# Altium schematic sheet Clock.SchDoc
size A2
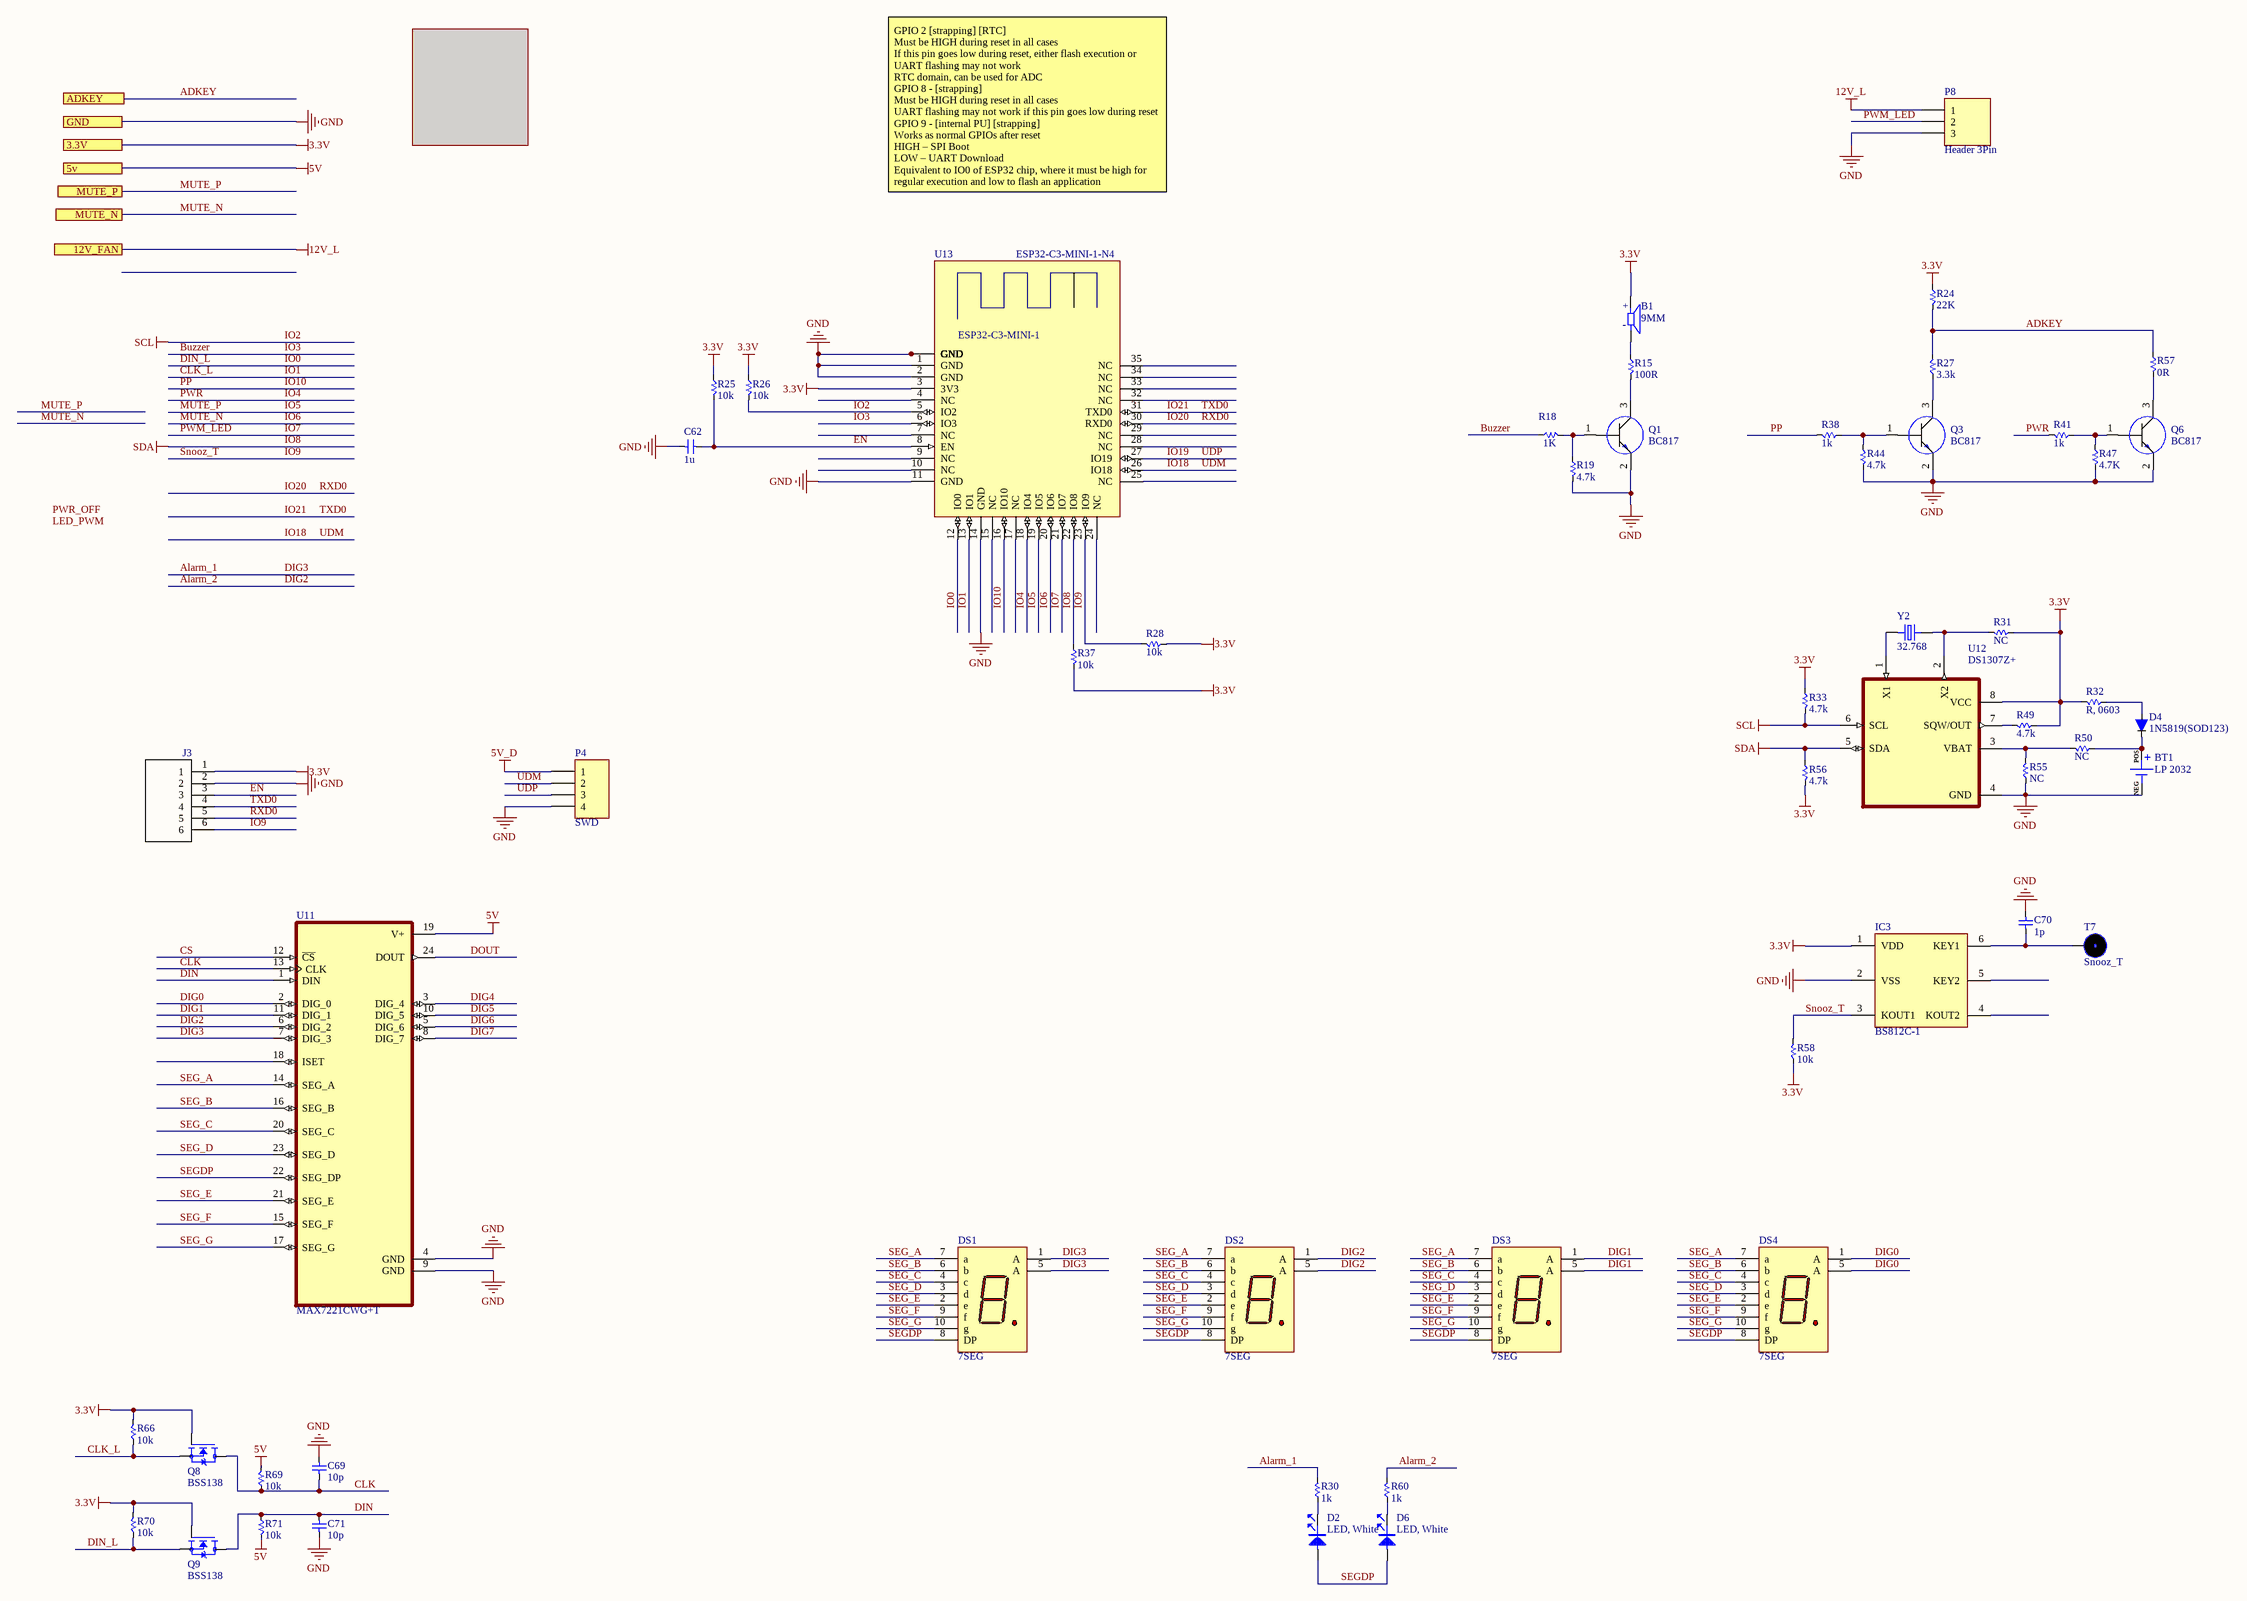
[diagram p0: Clock.SchDoc]

## Parts
B1  9MM  [Buzzer-TMB09A05]
BT1  LP 2032  [battery Holder 2032]
C62  1u  [cap0603]
C69  10p  [cap0603]
C70  1p  [cap0603]
C71  10p  [cap0603]
D2  LED, White  [LED 1206]
D4  1N5819(SOD123)  [1N5819 SOD-123]
D6  LED, White  [LED 1206]
DS1  7SEG  [7Seg 90*60 - No Wiring COMMON Cathod - 1206]
DS2  7SEG  [7Seg 90*60 - No Wiring COMMON Cathod - 1206]
DS3  7SEG  [7Seg 90*60 - No Wiring COMMON Cathod - 1206]
DS4  7SEG  [7Seg 90*60 - No Wiring COMMON Cathod - 1206]
IC3  BS812C-1  [BS812C-1]
J3  NC  [pin header1*6]  (value not drawn)
P4  SWD  [HDR1X4H]
P8  Header 3Pin  [CONN-PHOENIX-3.81 3Pin]
Q1  BC817  [BJT SS805]
Q3  BC817  [BJT SS805]
Q6  BC817  [BJT SS805]
Q8  BSS138  [BSS138]
Q9  BSS138  [BSS138]
R15  100R  [RES-0603]
R18  1K  [RES-0603]
R19  4.7k  [RES-0603]
R24  22K  [RES-0603]
R25  10k  [RES-0603]
R26  10k  [RES-0603]
R27  3.3k  [RES-0603]
R28  10k  [RES-0603]
R30  1k  [RES-0603]
R31  NC  [RES-0603]
R32  R, 0603  [RES-0603]
R33  4.7k  [RES-0603]
R37  10k  [RES-0603]
R38  1k  [RES-0603]
R41  1k  [RES-0603]
R44  4.7k  [RES-0603]
R47  4.7K  [RES-0603]
R49  4.7k  [RES-0603]
R50  NC  [RES-0603]
R55  NC  [RES-0603]
R56  4.7k  [RES-0603]
R57  0R  [RES-0603]
R58  10k  [RES-0603]
R60  1k  [RES-0603]
R66  10k  [RES-0603]
R69  10k  [RES-0603]
R70  10k  [RES-0603]
R71  10k  [RES-0603]
T7  Snooz_T  [Touch pad CIRCULE - 5mm]
U11  MAX7221CWG+T  [MAX7221CWG]
U12  DS1307Z+  [DS1307]
U13  ESP32-C3-MINI-1-N4  [ESP32-C3-MINI-1]
Y2  32.768  [Crystal_AB38T-32.768KHZ]

## Ports
3.3V, 5v, 12V_FAN, ADKEY, GND, MUTE_N, MUTE_P

## Nets
3.3V: B1.P IC3.1(VDD) J3.1 Q8.1(G) Q9.1(G) R24.1 R25.1 R26.1 R28.1 R31.1 R32.2 R33.1 R37.2 R49.1 R56.2 R58.1 R66.2 R70.2 U12.8(VCC) U13.3(3V3) ; port 3.3V
5V: R69.2 R71.2 U11.19(V+) ; port 5v
5V_D: P4.1
12V_L: P8.1 ; port 12V_FAN
GND: BT1.NEG C62.1 C69.1 C70.2 C71.2 IC3.2(VSS) J3.2 P4.4 P8.3 Q1.2(E) Q3.2(E) Q6.2(E) R19.2 R44.2 R47.2 R55.1 U11.4(GND) U11.9(GND) U12.4(GND) U13.1(GND) U13.2(GND) U13.11(GND) U13.14(GND) U13.36(GND) U13.37(GND) U13.38(GND) U13.39(GND) U13.40(GND) U13.41(GND) U13.42(GND) U13.43(GND) U13.44(GND) U13.45(GND) U13.46(GND) U13.47(GND) U13.48(GND) U13.49_1(GND) U13.49_2(GND) U13.49_3(GND) U13.49_4(GND) U13.49_5(GND) U13.49_6(GND) U13.49_7(GND) U13.49_8(GND) U13.49_9(GND) U13.50(GND) U13.51(GND) U13.52(GND) U13.53(GND) ; port GND
IO2: R26.2 R33.2 U12.6(SCL) U13.5(IO2)  [also labelled SCL]
IO8: R37.1 R56.1 U12.5(SDA) U13.22(IO8)  [also labelled SDA]
ADKEY: R24.2 R27.2 R57.1 ; port ADKEY
Alarm_1: DS1.1(A) DS1.5(A) R30.2 U11.7(DIG_3)  [also labelled DIG3]
Alarm_2: DS2.1(A) DS2.5(A) R60.2 U11.6(DIG_2)  [also labelled DIG2]
Buzzer: R18.1 U13.6(IO3)  [also labelled IO3]
CLK: C69.2 Q8.3(D) R69.1 U11.13(CLK)
CLK_L: Q8.2(S) R66.1 U13.13(IO1)  [also labelled IO1]
CS: U11.12(~{CS})
DIG0: DS4.1(A) DS4.5(A) U11.2(DIG_0)
DIG1: DS3.1(A) DS3.5(A) U11.11(DIG_1)
DIG4: U11.3(DIG_4)
DIG5: U11.10(DIG_5)
DIG6: U11.5(DIG_6)
DIG7: U11.8(DIG_7)
DIN: C71.1 Q9.3(D) R71.1 U11.1(DIN)
DIN_L: Q9.2(S) R70.1 U13.12(IO0)  [also labelled IO0]
DOUT: U11.24(DOUT)
EN: C62.2 J3.3 R25.2 U13.8(EN)
IO4: R41.2 U13.18(IO4)  [also labelled PWR]
IO5: U13.19(IO5) ; port MUTE_P  [also labelled MUTE_P]
IO6: U13.20(IO6) ; port MUTE_N  [also labelled MUTE_N]
IO7: P8.2 U13.21(IO7)  [also labelled PWM_LED]
IO9: IC3.3(KOUT1) J3.6 R28.2 R58.2 U13.23(IO9)  [also labelled Snooz_T]
IO10: R38.2 U13.16(IO10)  [also labelled PP]
IO18: P4.2 U13.26(IO18)  [also labelled UDM]
IO19: P4.3 U13.27(IO19)  [also labelled UDP]
IO20: J3.5 U13.30(RXD0)  [also labelled RXD0]
IO21: J3.4 U13.31(TXD0)  [also labelled TXD0]
SEG_A: DS1.7(a) DS2.7(a) DS3.7(a) DS4.7(a) U11.14(SEG_A)
SEG_B: DS1.6(b) DS2.6(b) DS3.6(b) DS4.6(b) U11.16(SEG_B)
SEG_C: DS1.4(c) DS2.4(c) DS3.4(c) DS4.4(c) U11.20(SEG_C)
SEG_D: DS1.3(d) DS2.3(d) DS3.3(d) DS4.3(d) U11.23(SEG_D)
SEG_E: DS1.2(e) DS2.2(e) DS3.2(e) DS4.2(e) U11.21(SEG_E)
SEG_F: DS1.9(f) DS2.9(f) DS3.9(f) DS4.9(f) U11.15(SEG_F)
SEG_G: DS1.10(g) DS2.10(g) DS3.10(g) DS4.10(g) U11.17(SEG_G)
SEGDP: D2.2 D6.2 DS1.8(DP) DS2.8(DP) DS3.8(DP) DS4.8(DP) U11.22(SEG_DP)
NetB1_N: B1.N R15.1
NetBT1_POS: BT1.POS D4.1(A) R50.1
NetC70_1: C70.1 IC3.6(KEY1) T7.1
NetD2_1: D2.1 R30.1
NetD4_2: D4.2(C) R32.1
NetD6_1: D6.1 R60.1
NetQ1_1: Q1.1(B) R18.2 R19.1
NetQ1_3: Q1.3(C) R15.2
NetQ3_1: Q3.1(B) R38.1 R44.1
NetQ3_3: Q3.3(C) R27.1
NetQ6_1: Q6.1(B) R41.1 R47.1
NetQ6_3: Q6.3(C) R57.2
NetR31_2: R31.2 U12.2(X2) Y2.2
NetR49_2: R49.2 U12.7(SQW/OUT)
NetR50_2: R50.2 R55.2 U12.3(VBAT)
NetU12_1: U12.1(X1) Y2.1

Not connected (* = marked no-connect by the designer): IC3 4(KOUT2) 5(KEY2); U11 18(ISET); U13 4(NC) 7(NC) 9(NC) 10(NC) 15(NC) 17(NC) 24(NC) 25(NC) 28(NC) 29(NC) 32(NC) 33(NC) 34(NC) 35(NC)

## Notes on the sheet
- GPIO 2 [strapping] [RTC]
  Must be HIGH during reset in all cases
  If this pin goes low during reset, either flash execution or UART flashing may not work
  RTC domain, can be used for ADC
  GPIO 8 - [strapping]
  Must be HIGH during reset in all cases
  UART flashing may not work if this pin goes low during reset
  GPIO 9 - [internal PU] [strapping]
  Works as normal GPIOs after reset
  HIGH – SPI Boot
  LOW – UART Download
  Equivalent to IO0 of ESP32 chip, where it must be high for regular execution and low to flash an application
- Labels drawn without touching a wire or pin: LED_PWM, PWR_OFF
- (in symbol Buzzer_9MM) +; -
- (in symbol ESP32-C3-MINI-1-N4) ESP32-C3-MINI-1

## Library data of the parts
B1 = Buzzer_9MM: 09 mm, 5 V, 85 dB, Through Hole, Magnetic Audio Transducer Buzzer; MF: CUI Devices; MP: CEM-1203(42); Package: None; Price: None; Check_prices: https://www.snapeda.com/parts/CEM-1203(42)/CUI+Devices/view-part/?ref=eda; Value: *; CUI_purchase_URL: https://www.cuidevices.com/product/audio/buzzers/audio-transducers/cem-1203(42)?utm_source=snapeda.com&utm_medium=referral&utm_campaign=snapedaBOM; SnapEDA_Link: https://www.snapeda.com/parts/CEM-1203(42)/CUI+Devices/view-part/?ref=snap; Availability: In Stock; Purchase-URL: https://pricing.snapeda.com/search/part/CEM-1203(42)/?ref=eda
BT1 = Battery Holder 2032: Battery Holder (Open) Coin, 20.0mm 1 Cell SMD (SMT) Tab; MP: LP2032SM-JJ-GTR; MF: MPD; DigiKey-Purchase-URL: https://snapeda.com/shop?store=DigiKey&id=288457; Value: *; Package: Non-Standard MPD; Price: None; SnapEDA_Link: https://www.snapeda.com/parts/LP2032SM-JJ-GTR/MPD%20(Memory%20Protection%20Devices)/view-part/288457/?ref=snap; Availability: Warning
C62 C69-C71 = Cap 0603: Capacitor 0603; Value: 104; Published: 8-Jun-2000; LatestRevisionDate: 17-Jul-2002; LatestRevisionNote: Re-released for DXP Platform.; Publisher: Altium Limited
D2 D6 = LED_red 1206: LED, red, 1206; Manuf_1: everlight; Manuf_Part_1: 19-213-R6C-AP1Q2B/3T; ECCN_US/EU: EAR99/NEC; Order: 19-213-R6C-AP1Q2B/3T
D4 = 1N5819(SOD123): Shotkey diod SOD-123; MP: BAS716; MF: Nexperia USA; SnapEDA_Link: https://www.snapeda.com/parts/BAS716/Nexperia%20USA%20Inc./view-part/143287/?ref=snap; Price: None; Package: SOD-523 NXP Semiconductors; Arrow_Electronics-Purchase-URL: https://snapeda.com/shop?store=Arrow+Electronics&id=143287; Value: *; Availability: Unavailable
DS1-DS4 = 7SEG 90*60mm: 7-Segment Display 90*60mm; LED_Colour: As AlInGaP Red; Published: 26-May-2004; LatestRevisionDate: 11-Oct-2004; LatestRevisionNote: Display outline superimposed on PCB Footprint.; DatasheetDocument: 20-Nov-2001; PackageDocument: 01-Oct-2001; PackageReference: Case-5; Publisher: Altium Limited; ComponentLink1Description: Manufacturer Link; ComponentLink1URL: http://www.agilent.com/; ComponentLink2Description: Datasheet; ComponentLink2URL: http://cp.literature.agilent.com/litweb/pdf/5988-4823EN.pdf
IC3 = BS812C-1: Integrated Circuit; Manufacturer_Name: Holtek; Manufacturer_Part_Number: BS814A-1; Datasheet Link: https://www.holtek.com/documents/10179/116711/BS81xA-xv150.pdf; Height: 1.1mm
J3 = pin header 06: Pin Connector 06 MODII HDR SRST B/A .100CL 6 POS; MF: TE Connectivity; MP: 5-146283-6; Price: None; SnapEDA_Link: https://www.snapeda.com/parts/5-146283-6/TE%20Connectivity%20AMP%20Connectors/view-part/?ref=snap; Availability: Unavailable; TE_purchase_URL: https://www.te.com/usa-en/product-5-146283-6.html?te_bu=Cor&te_type=disp&te_campaign=seda_glo_cor-seda-global-disp-prtnr-fy19-seda-model-bom-cta_sma-317_1&elqCampaignId=32493; Package: None; Value: *
P4 = pin header 1X4: Header, 4-Pin; LatestRevisionDate: 17-Jul-2002; LatestRevisionNote: Re-released for DXP Platform.; Publisher: Altium Limited
P8 = CONN-Phoenix-3.81 3Pin: Phoenix Connector 3.81; LatestRevisionDate: 17-Jul-2002; LatestRevisionNote: Re-released for DXP Platform.; Publisher: Altium Limited
Q1 Q3 Q6 = SS8050-G BJT_ Transistor: Bipolar _BJT_ Transistor NPN 25V 1.5A 100MHz 300mW Surface Mount SOT-23; MF: Comchip Technology; SnapEDA_Link: https://www.snapeda.com/parts/SS8050-G/Comchip%20Technology/view-part/809142/?ref=snap; Price: None; MP: SS8050-G; Package: TO-236 Comchip; Availability: Unavailable; Value: *
R15 R18 R19 R24-R28 R30-R33 R37 R38 R41 R44 R47 R49 R50 R55-R58 R60 R66 R69-R71 = Res 0603: Resistor 0603; Published: 8-Jun-2000; LatestRevisionDate: 29-May-2009; LatestRevisionNote: IPC-7351 Footprint Added.; PackageReference: J1-0603; Publisher: Altium Limited; PackageDescription: Chip Resistor
  R18 R19 R24-R27 R38 R41 R44 R47 R57 R58: Value: *
T7 = touch pad 5mm
U11 = MAX7221CWG+T: LED Driver 64 Segment 330000uA Supply Current 24-Pin SOIC W T/R; MF: Maxim Integrated Products; MP: MAX7221CWG+T; Purchase-URL: https://pricing.snapeda.com/search/part/MAX7221CWG+T/?ref=eda; SnapEDA_Link: https://www.snapeda.com/parts/MAX7221CWG+T/Maxim+Integrated/view-part/?ref=snap; Price: None; Package: None; Value: *; Check_prices: https://www.snapeda.com/parts/MAX7221CWG+T/Maxim+Integrated/view-part/?ref=eda; Availability: In Stock
U12 = DS1307Z+: Real Time Clock _RTC_ IC Clock/Calendar 56B IÂ²C, 2-Wire Serial 8-SOIC _0.154, 3.90mm Width_; MF: Maxim Integrated; Availability: Unavailable; SnapEDA_Link: https://www.snapeda.com/parts/DS1307Z/Maxim%20Integrated/view-part/524266/?ref=snap; Price: None; Package: SO-8 Maxim Integrated; MP: DS1307Z; Value: *
U13 = ESP32-C3-MINI-1-N4: MF: {'manufacturer': u'Espressif Systems'}; Package: None; Price: None; Value: *; MP: ESP32-C3-MINI-1-N4; Availability: Unavailable
Y2 = Crystal 32.768KHz: 32.768 KHz Dip ±20ppm 12.5pf; MP: ECS-130-20-3X-TR; MF: ECS Inc.; Value: *; SnapEDA_Link: https://www.snapeda.com/parts/ECS-130-20-3X-TR/ECS%20Inc./view-part/2459108/?ref=snap; Check_prices: https://www.snapeda.com/parts/ECS-130-20-3X-TR/ECS%20Inc./view-part/2459108/?ref=eda; Purchase-URL: https://pricing.snapeda.com/search/part/ECS-130-20-3X-TR/?ref=eda; Availability: Warning; Price: None; Package: HC49/US ECS International